# Altium schematic sheet Relay_Driver.SchDoc
size A; SheetNumber: 10; SheetTotal: 10
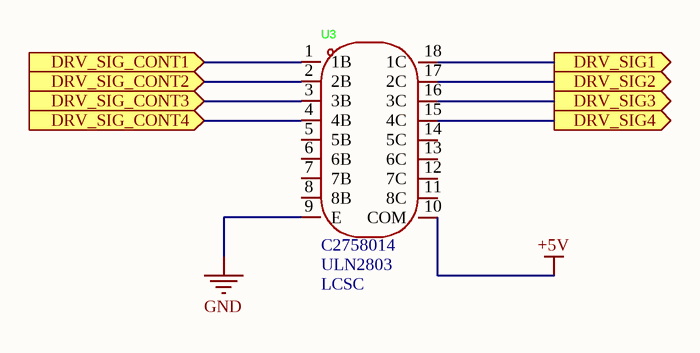
[diagram p0: Relay_Driver.SchDoc]

## Parts
U3  Supplier Part: C2758014  Supplier: LCSC  [SOP-18_L11.6-W7.5-P1.27-LS10.3-BL]  (hidden comment: ULN2803)

## Ports
DRV_SIG1 (out), DRV_SIG2 (out), DRV_SIG3 (out), DRV_SIG4 (out), DRV_SIG_CONT1 (in), DRV_SIG_CONT2 (in), DRV_SIG_CONT3 (in), DRV_SIG_CONT4 (in)

## Nets
+5V: U3.10(COM)
GND: U3.9(E)
DRV_SIG1: U3.18(1C) ; port DRV_SIG1
DRV_SIG2: U3.17(2C) ; port DRV_SIG2
DRV_SIG3: U3.16(3C) ; port DRV_SIG3
DRV_SIG4: U3.15(4C) ; port DRV_SIG4
DRV_SIG_CONT1: U3.1(1B) ; port DRV_SIG_CONT1
DRV_SIG_CONT2: U3.2(2B) ; port DRV_SIG_CONT2
DRV_SIG_CONT3: U3.3(3B) ; port DRV_SIG_CONT3
DRV_SIG_CONT4: U3.4(4B) ; port DRV_SIG_CONT4

Not connected (* = marked no-connect by the designer): U3 5(5B) 6(6B) 7(7B) 8(8B) 11(8C) 12(7C) 13(6C) 14(5C)

## Library data of the parts
U3 = ULN2803_C2758014: Manufacturer: Siproin(上海矽朋); Add into BOM: yes; number of channels: 8; Collector - Emitter Voltage VCEO: 50V; Current - Collector(Ic): 500mA; Voltage - Input(Max): 30V; Input Current(off): 65uA; Voltage - Forward(Vf): 1.7V; Reverse Leakage Current (Ir): 100uA; Input Capacitiance(Ci): 15pF; Symbol: ULN2803_C2758014; Device: ULN2803_C2758014; Supplier Footprint: SOP-18-300mil; LCSC Part Name: 高压大电流达林顿晶体管阵列; JLCPCB Part Class: Extended Part; Datasheet: https://item.szlcsc.com/datasheet/ULN2803/2875179.html; Convert to PCB: yes; Operating Temperature: -20℃~+70℃; Manufacturer Part: ULN2803